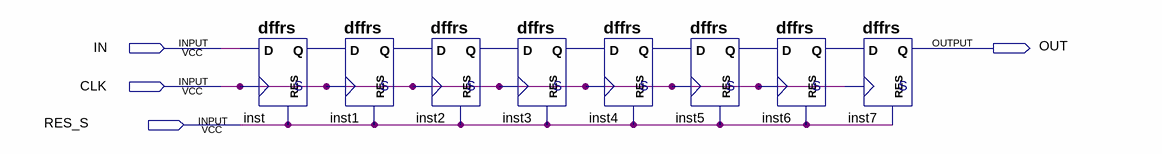
[diagram p0: schematic sheet]
// Quartus schematic sr8r.bdf as structural Verilog: 8 symbols, 4 pins
module sr8r (
  input  IN,
  input  CLK,
  input  RES_S,
  output OUT
);

  wire inst1_q, inst2_q, inst3_q, inst4_q, inst5_q, inst6_q, inst_q;

  dffrs inst (.D(IN), .RES(RES_S), .CK(CLK), .Q(inst_q));
  dffrs inst1 (.D(inst_q), .RES(RES_S), .CK(CLK), .Q(inst1_q));
  dffrs inst2 (.D(inst1_q), .RES(RES_S), .CK(CLK), .Q(inst2_q));
  dffrs inst3 (.D(inst2_q), .RES(RES_S), .CK(CLK), .Q(inst3_q));
  dffrs inst4 (.D(inst3_q), .RES(RES_S), .CK(CLK), .Q(inst4_q));
  dffrs inst5 (.D(inst4_q), .RES(RES_S), .CK(CLK), .Q(inst5_q));
  dffrs inst6 (.D(inst5_q), .RES(RES_S), .CK(CLK), .Q(inst6_q));
  dffrs inst7 (.D(inst6_q), .RES(RES_S), .CK(CLK), .Q(OUT));
endmodule
